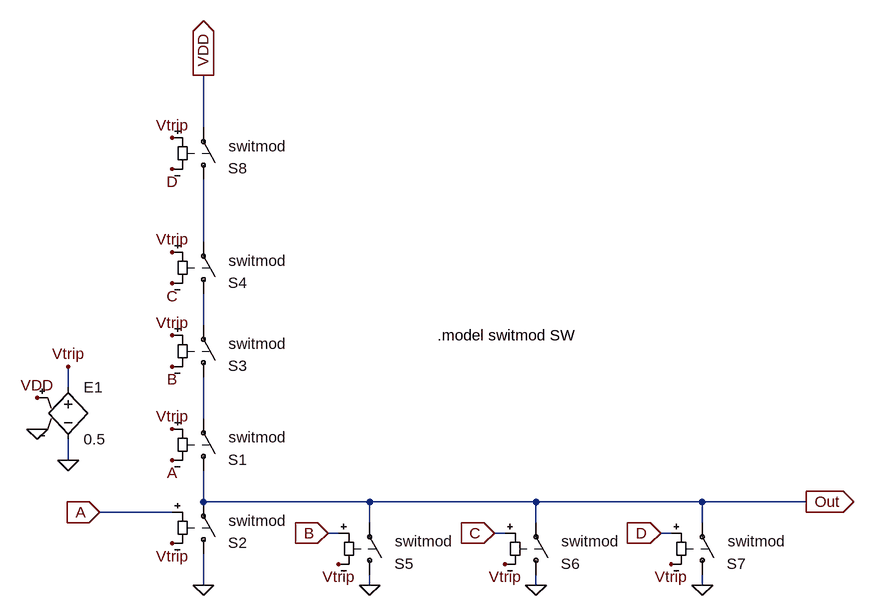
[diagram p0: schematic Ideal_NOR_4.asc]
Ideal_NOR_4.asc, the LTspice schematic file:
Version 4
SHEET 1 6288 680
WIRE 1184 -1104 1184 -1184
WIRE 1184 -928 1184 -1024
WIRE 1184 -800 1184 -848
WIRE 976 -704 976 -736
WIRE 1184 -656 1184 -720
WIRE 976 -592 976 -624
WIRE 1184 -528 1184 -576
WIRE 1440 -528 1184 -528
WIRE 1696 -528 1440 -528
WIRE 1952 -528 1696 -528
WIRE 2112 -528 1952 -528
WIRE 1136 -512 1024 -512
WIRE 1440 -496 1440 -528
WIRE 1696 -496 1696 -528
WIRE 1952 -496 1952 -528
WIRE 1392 -480 1376 -480
WIRE 1648 -480 1632 -480
WIRE 1904 -480 1888 -480
WIRE 1184 -400 1184 -448
WIRE 1440 -400 1440 -416
WIRE 1696 -400 1696 -416
WIRE 1952 -400 1952 -416
FLAG 1024 -512 A
IOPIN 1024 -512 In
FLAG 1184 -1184 VDD
IOPIN 1184 -1184 Out
FLAG 1696 -400 0
FLAG 2112 -528 Out
IOPIN 2112 -528 Out
FLAG 976 -592 0
FLAG 928 -640 0
FLAG 928 -688 VDD
FLAG 976 -736 Vtrip
FLAG 1136 -592 A
FLAG 1136 -736 B
FLAG 1376 -480 B
IOPIN 1376 -480 In
FLAG 1136 -864 C
FLAG 1632 -480 C
IOPIN 1632 -480 In
FLAG 1136 -912 Vtrip
FLAG 1136 -784 Vtrip
FLAG 1136 -640 Vtrip
FLAG 1136 -464 Vtrip
FLAG 1392 -432 Vtrip
FLAG 1648 -432 Vtrip
FLAG 1440 -400 0
FLAG 1184 -400 0
FLAG 1952 -400 0
FLAG 1888 -480 D
IOPIN 1888 -480 In
FLAG 1904 -432 Vtrip
FLAG 1136 -1040 D
FLAG 1136 -1088 Vtrip
SYMBOL sw 1184 -560 M180
WINDOW 3 24 -12 Left 0
WINDOW 38 39 67 Left 0
WINDOW 0 38 33 Left 0
SYMATTR Value ""
SYMATTR SpiceModel switmod
SYMATTR InstName S1
SYMBOL sw 1184 -432 M180
WINDOW 3 24 -12 Left 0
WINDOW 38 39 67 Left 0
WINDOW 0 38 33 Left 0
SYMATTR Value ""
SYMATTR SpiceModel switmod
SYMATTR InstName S2
SYMBOL e 976 -720 R0
SYMATTR InstName E1
SYMATTR Value 0.5
SYMBOL sw 1184 -704 M180
WINDOW 3 24 -12 Left 0
WINDOW 38 39 67 Left 0
WINDOW 0 38 33 Left 0
SYMATTR Value ""
SYMATTR SpiceModel switmod
SYMATTR InstName S3
SYMBOL sw 1184 -832 M180
WINDOW 3 24 -12 Left 0
WINDOW 38 39 67 Left 0
WINDOW 0 38 33 Left 0
SYMATTR Value ""
SYMATTR SpiceModel switmod
SYMATTR InstName S4
SYMBOL sw 1440 -400 M180
WINDOW 3 24 -12 Left 0
WINDOW 38 39 67 Left 0
WINDOW 0 38 33 Left 0
SYMATTR Value ""
SYMATTR SpiceModel switmod
SYMATTR InstName S5
SYMBOL sw 1696 -400 M180
WINDOW 3 24 -12 Left 0
WINDOW 38 39 67 Left 0
WINDOW 0 38 33 Left 0
SYMATTR Value ""
SYMATTR SpiceModel switmod
SYMATTR InstName S6
SYMBOL sw 1952 -400 M180
WINDOW 3 24 -12 Left 0
WINDOW 38 39 67 Left 0
WINDOW 0 38 33 Left 0
SYMATTR Value ""
SYMATTR SpiceModel switmod
SYMATTR InstName S7
SYMBOL sw 1184 -1008 M180
WINDOW 3 24 -12 Left 0
WINDOW 38 39 67 Left 0
WINDOW 0 38 33 Left 0
SYMATTR Value ""
SYMATTR SpiceModel switmod
SYMATTR InstName S8
TEXT 1544 -784 Left 0 !.model switmod SW

The netlist it stands for:
* Ideal_NOR_4.asc
S1 Out N003 Vtrip A switmod
S2 0 Out A Vtrip switmod
E1 Vtrip 0 VDD 0 0.5
S3 N003 N002 Vtrip B switmod
S4 N002 N001 Vtrip C switmod
S5 0 Out B Vtrip switmod
S6 0 Out C Vtrip switmod
S7 0 Out D Vtrip switmod
S8 N001 VDD Vtrip D switmod
.model switmod SW
.backanno
.end